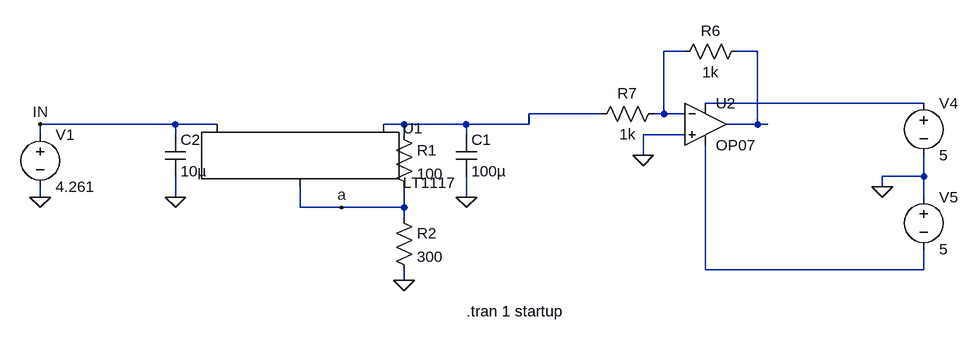
[diagram p0: schematic power supply .asc]
power supply .asc, the LTspice schematic file:
Version 4
SHEET 1 1272 684
WIRE 800 48 768 48
WIRE 912 48 880 48
WIRE 1168 128 832 128
WIRE 672 144 560 144
WIRE 768 144 768 48
WIRE 768 144 752 144
WIRE 800 144 768 144
WIRE 16 160 -192 160
WIRE 80 160 16 160
WIRE 368 160 336 160
WIRE 464 160 368 160
WIRE 560 160 560 144
WIRE 560 160 464 160
WIRE 912 160 912 48
WIRE 912 160 864 160
WIRE 928 160 912 160
WIRE -192 176 -192 160
WIRE 16 176 16 160
WIRE 368 176 368 160
WIRE 464 176 464 160
WIRE 800 176 736 176
WIRE 736 208 736 176
WIRE 1168 240 1168 208
WIRE 1168 240 1104 240
WIRE 1104 256 1104 240
WIRE -192 272 -192 256
WIRE 16 272 16 240
WIRE 464 272 464 240
WIRE 1168 272 1168 240
WIRE 208 288 208 256
WIRE 272 288 208 288
WIRE 368 288 368 256
WIRE 368 288 272 288
WIRE 368 304 368 288
WIRE 832 384 832 192
WIRE 1168 384 1168 352
WIRE 1168 384 832 384
WIRE 368 400 368 384
FLAG 16 272 0
FLAG -192 272 0
FLAG -192 160 IN
FLAG 368 400 0
FLAG 464 272 0
FLAG 272 288 a
FLAG 1104 256 0
FLAG 736 208 0
SYMBOL LT1117 208 160 R0
SYMATTR InstName U1
SYMBOL res 352 160 R0
SYMATTR InstName R1
SYMATTR Value 100
SYMBOL res 352 288 R0
SYMATTR InstName R2
SYMATTR Value 300
SYMBOL cap 448 176 R0
SYMATTR InstName C1
SYMATTR Value 100µ
SYMATTR SpiceLine Rser=10m
SYMBOL cap 0 176 R0
SYMATTR InstName C2
SYMATTR Value 10µ
SYMBOL voltage -192 160 R0
WINDOW 123 0 0 Left 2
WINDOW 39 0 0 Left 2
SYMATTR InstName V1
SYMATTR Value 4.261
SYMBOL Voltage 1168 112 R0
SYMATTR InstName V4
SYMATTR Value 5
SYMBOL Voltage 1168 256 R0
SYMATTR InstName V5
SYMATTR Value 5
SYMBOL Res 896 32 R90
WINDOW 0 0 56 VBottom 2
WINDOW 3 32 56 VTop 2
SYMATTR InstName R6
SYMATTR Value 1k
SYMBOL Res 768 128 R90
WINDOW 0 0 56 VBottom 2
WINDOW 3 32 56 VTop 2
SYMATTR InstName R7
SYMATTR Value 1k
SYMBOL OpAmps/OP07 832 96 R0
SYMATTR InstName U2
TEXT 464 448 Left 2 !.tran 1 startup

The netlist it stands for:
* power supply .asc
XU1 a N004 IN LT1117
R1 N004 a 100
R2 a 0 300
C1 N004 0 100µ Rser=10m
C2 IN 0 10µ
V1 IN 0 4.261
V4 N003 0 5
V5 0 N005 5
R6 N002 N001 1k
R7 N001 N004 1k
XU2 0 N001 N003 N005 N002 LT1001  ; OP07, pins In+ In- V+ V- OUT
.tran 1 startup
.lib LT1117.lib
.lib LTC.lib
.backanno
.end